# EAGLE design 5vac-dcreg (EAGLE 9.6.2)
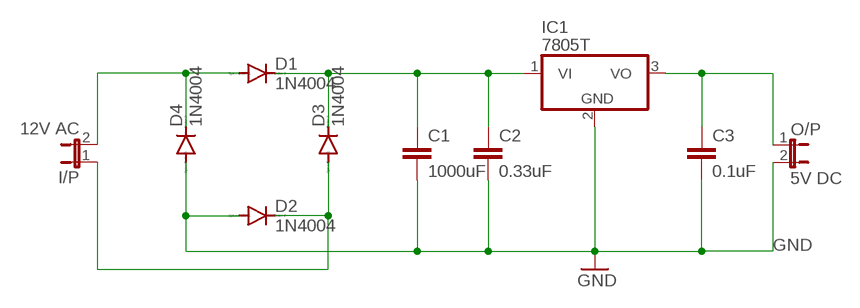
[diagram p0: schematic, sheet 1]

## Parts
C1  1000uF  C2,5-3  [C2.5-3]
C2  0.33uF  C2,5-3  [C2.5-3]
C3  0.1uF  C2,5-3  [C2.5-3]
D1  1N4004  [DO41-10]
D2  1N4004  [DO41-10]
D3  1N4004  [DO41-10]
D4  1N4004  [DO41-10]
I/P  12V AC  JP1E  [JP1]
IC1  7805T  [TO220H]
O/P  5V DC  JP1E  [JP1]

## Nets
GND: C1.2 C2.2 C3.2 D2.A D4.A IC1.2(GND) O/P.2
N$2: D2.C D3.A I/P.1
N$3: C1.1 C2.1 D1.C D3.C IC1.1(VI)
N$4: D1.A D4.C I/P.2
N$5: C3.1 IC1.3(VO) O/P.1

## Library data of the parts
C1-C3 = capacitor-wima:C: CAPACITOR naming: grid - package width
D1-D4 = diode:1N4004: DIODE general purpose rectifier, 1 A
I/P O/P = jumper:JP1E: JUMPER
IC1 = linear:78*: Positive VOLTAGE REGULATOR Source: http://cache.national.com/ds/LM/LM78L05.pdf http://www.fairchildsemi.com/ds/LM/LM7805.pdf

## Board
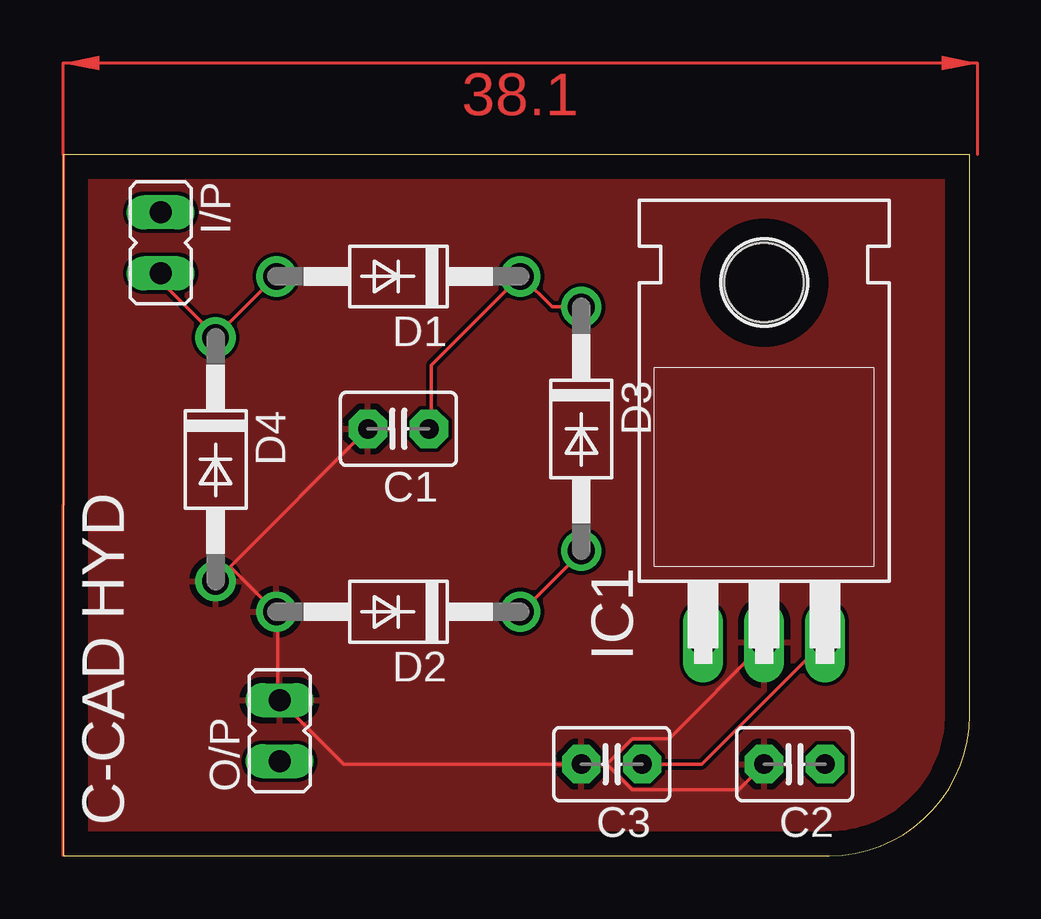
[diagram p1: board, top side]
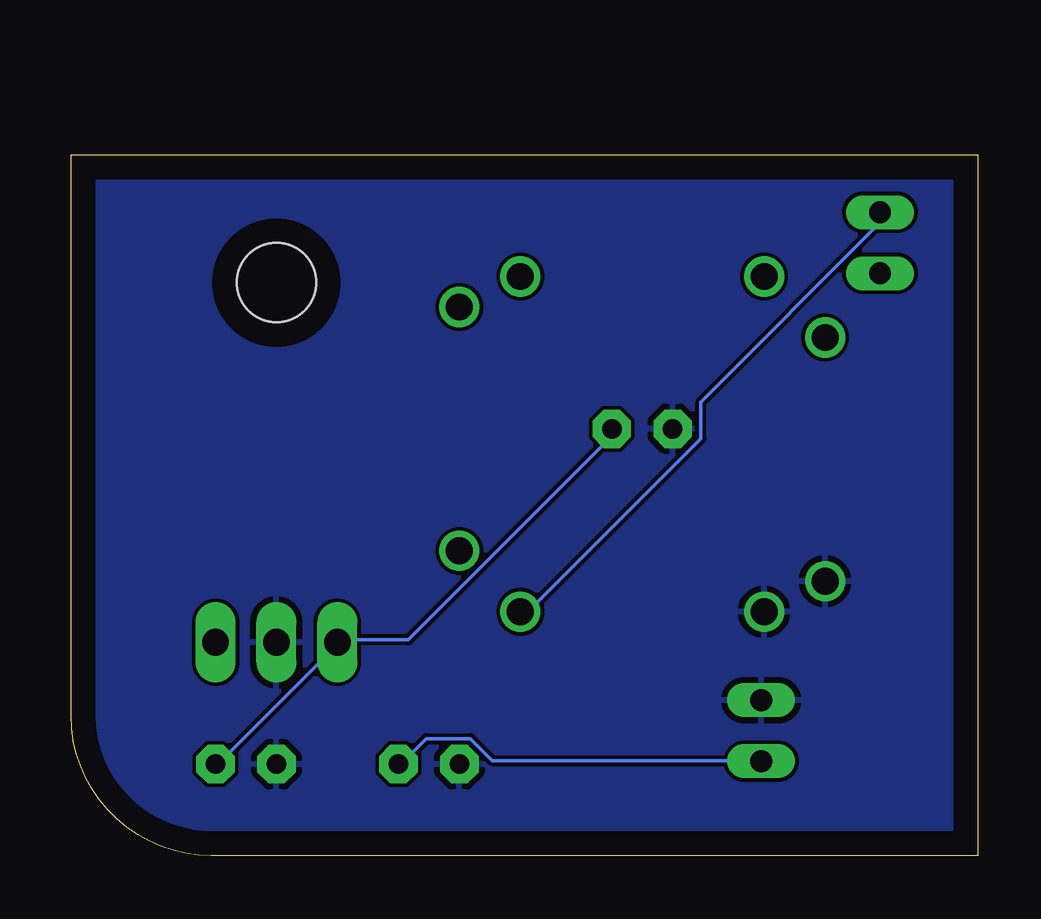
[diagram p2: board, bottom side, seen from below]

Size 37.77 x 29.2 mm. Coordinates in mm from the lower left corner, seen from the top.
Outline: 0,0 31.92,0 arc90 37.77,5.85 37.77,29.2 0,29.2 0,0
Copper layers (1*16): Top 0.035mm / dielectric 1.5mm / Bottom 0.035mm
Design rules "default": minimum track width 6mil, minimum drill 0.35mm, track to track 6mil, track to pad 6mil, pad to pad 6mil, via to via 6mil, smd to smd 6mil, copper to edge 40mil, drill to drill 6mil, minimum pad ring 10mil, minimum via ring 8mil, stop-mask expansion 4mil, vias tented up to drill 0mil, thermal gap 10mil

### Footprints (pad centres in the part's own frame; a part is rotated, then mirrored left to right if it is on the bottom)
C2.5-3 = drill 0.813 pad 1.6 octagon: 1 -1.27,0; 2 1.27,0
DO41-10 = drill 1.118: A 5.08,0; C -5.08,0
JP1 = drill 0.914 long: 1 0,-1.27; 2 0,1.27
TO220H = drill 1.118 long: 1 -2.54,-10.16; 2 0,-10.16; 3 2.54,-10.16 | hole 3.302: 0,4.826

### Placement (x,y rotation side)
C1  13.97,17.78 180 top
C2  30.48,3.81 180 top
C3  22.86,3.81 180 top
D1  13.97,24.13 180 top
D2  13.97,10.16 180 top
D3  21.59,17.78 270 top
D4  6.35,16.51 270 top
I/P  4.06,25.53 180 top
IC1  29.21,19.05 0 top
O/P  9.02,5.21 0 top

### Tracks (layer width: path | path; a pad name or v marks a point on that pad's centre or on a via)
GND
  Top 0.152: 22.66,3.81 C3.2 11.68,3.81 O/P.2 8.94,6.55 8.94,10.06 D2.A 8.79,10.21 6.96,12.04 | 22.66,3.81 23.72,2.74 28.14,2.74 C2.2 | 22.66,3.81 23.72,4.88 25.25,4.88 29.21,8.84 IC1.2 | D4.A 6.96,12.04 | 6.96,12.04 C1.2
  pour Top: -1.27,30.48 39.37,30.48 39.37,0 39.37,-1.27 -1.27,-1.27
  pour Bottom: -1.27,31.75 40.64,31.75 40.64,-2.54 -2.54,-2.54 -2.54,31.75
N$2
  Top 0.152: D3.A 21.59,12.65 19.15,10.21 D2.C
  Bottom 0.152: I/P.1 4.06,26.37 11.53,18.9 11.53,17.37 18.69,10.21 19,10.21 D2.C
N$3
  Top 0.152: C1.1 15.34,17.83 15.34,20.42 D1.C 19.15,24.08 20.37,22.86 D3.C
  Bottom 0.152: C2.1 31.65,3.81 26.62,8.84 IC1.1 26.62,8.99 23.72,8.99 15.34,17.37 15.34,17.68 C1.1
N$4
  Top 0.152: I/P.2 4.06,23.93 6.35,21.64 | 6.35,21.64 8.79,24.08 D1.A | 6.35,21.64 D4.C
N$5
  Top 0.152: C3.1 26.62,3.81 31.65,8.84 IC1.3
  Bottom 0.152: O/P.1 9.09,3.96 20.22,3.96 21.13,4.88 22.96,4.88 24.03,3.81 C3.1
(copper drawn outside any net)
  shapes: Top area x2

### Text on the board
tPlace: C-CAD HYD